# EAGLE design Bus Definition V1.2 (EAGLE 7.6.0)
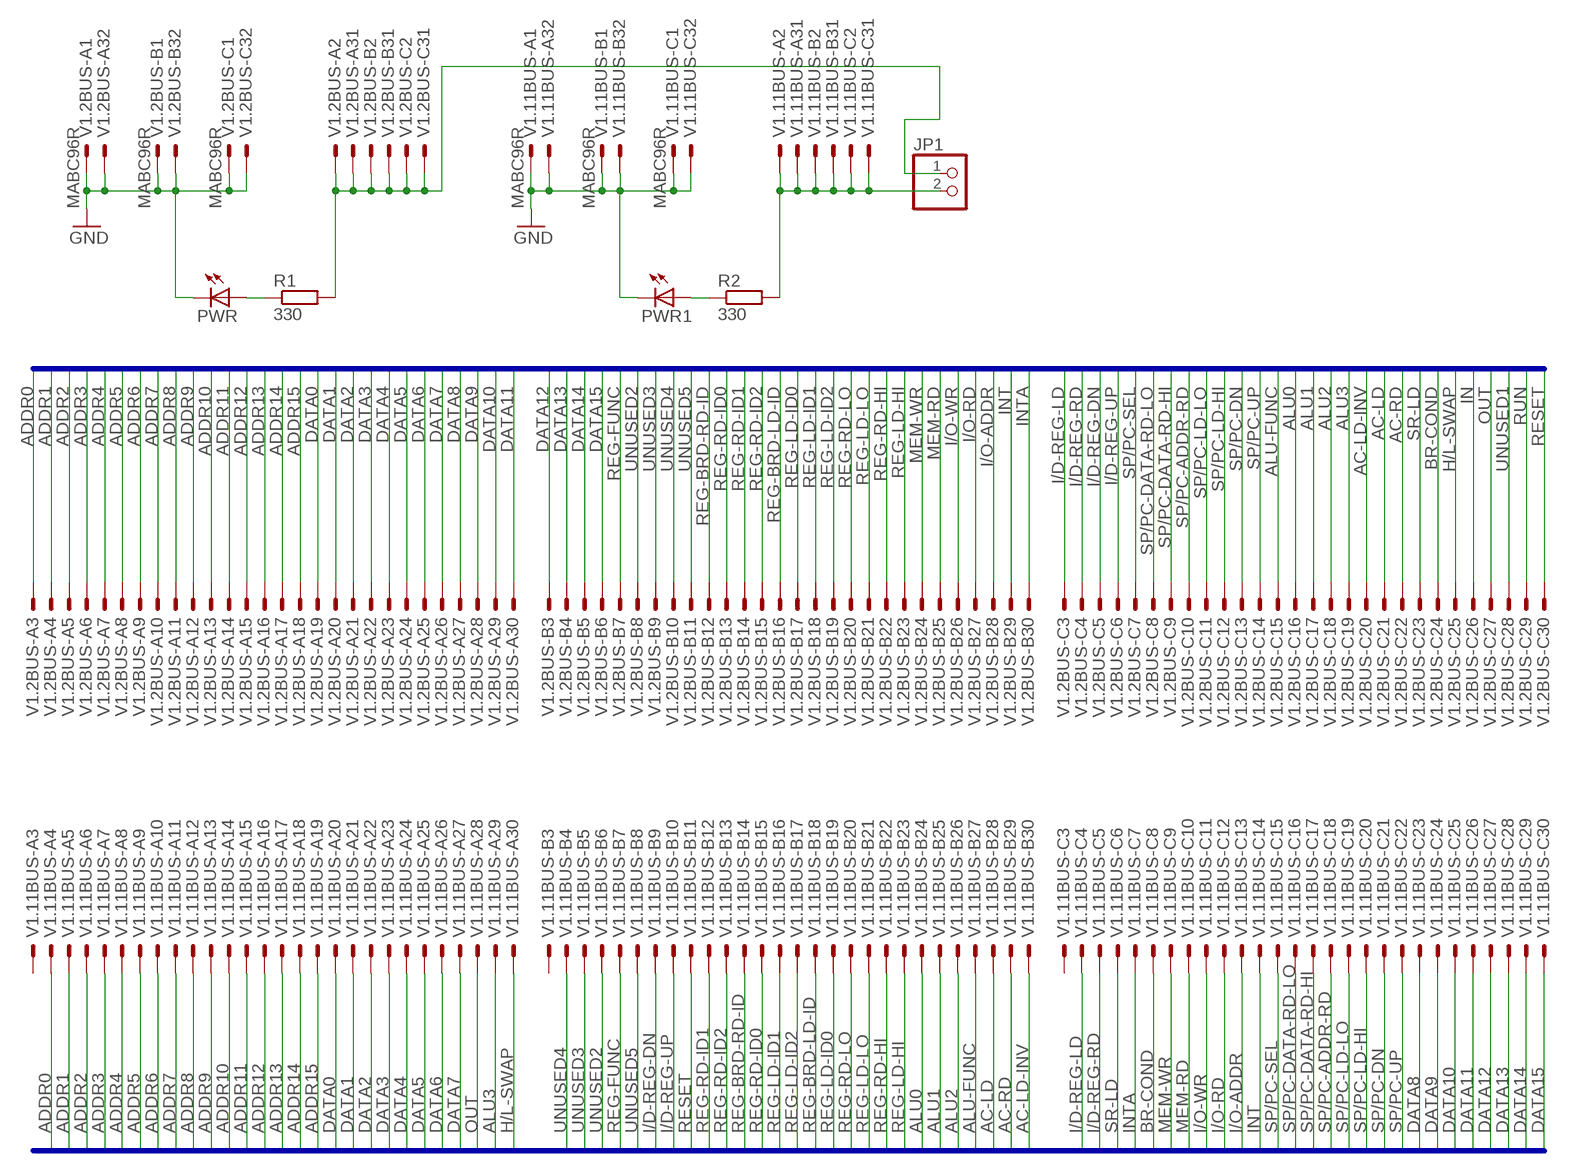
[diagram p0: schematic, sheet 1]

## Parts
JP1  PINHD-1X2  [1X02]
PWR  LED5MM  [LED5MM]
PWR1  LED5MM  [LED5MM]
R1  330  R0207/10  [0207/10]
R2  330  R0207/10  [0207/10]
V1.2BUS  MABC96R  [MABC96R]
V1.11BUS  MABC96R  [MABC96R]

## Nets
AC-LD: V1.2BUS.C21 V1.11BUS.B28
AC-LD-INV: V1.2BUS.C20 V1.11BUS.B30
AC-RD: V1.2BUS.C22 V1.11BUS.B29
ADDR0: V1.2BUS.A3 V1.11BUS.A4
ADDR1: V1.2BUS.A4 V1.11BUS.A5
ADDR2: V1.2BUS.A5 V1.11BUS.A6
ADDR3: V1.2BUS.A6 V1.11BUS.A7
ADDR4: V1.2BUS.A7 V1.11BUS.A8
ADDR5: V1.2BUS.A8 V1.11BUS.A9
ADDR6: V1.2BUS.A9 V1.11BUS.A10
ADDR7: V1.2BUS.A10 V1.11BUS.A11
ADDR8: V1.2BUS.A11 V1.11BUS.A12
ADDR9: V1.2BUS.A12 V1.11BUS.A13
ADDR10: V1.2BUS.A13 V1.11BUS.A14
ADDR11: V1.2BUS.A14 V1.11BUS.A15
ADDR12: V1.2BUS.A15 V1.11BUS.A16
ADDR13: V1.2BUS.A16 V1.11BUS.A17
ADDR14: V1.2BUS.A17 V1.11BUS.A18
ADDR15: V1.2BUS.A18 V1.11BUS.A19
ALU0: V1.2BUS.C16 V1.11BUS.B24
ALU1: V1.2BUS.C17 V1.11BUS.B25
ALU2: V1.2BUS.C18 V1.11BUS.B26
ALU3: V1.2BUS.C19 V1.11BUS.A29
ALU-FUNC: V1.2BUS.C15 V1.11BUS.B27
BR-COND: V1.2BUS.C24 V1.11BUS.C8
DATA0: V1.2BUS.A19 V1.11BUS.A20
DATA1: V1.2BUS.A20 V1.11BUS.A21
DATA2: V1.2BUS.A21 V1.11BUS.A22
DATA3: V1.2BUS.A22 V1.11BUS.A23
DATA4: V1.2BUS.A23 V1.11BUS.A24
DATA5: V1.2BUS.A24 V1.11BUS.A25
DATA6: V1.2BUS.A25 V1.11BUS.A26
DATA7: V1.2BUS.A26 V1.11BUS.A27
DATA8: V1.2BUS.A27 V1.11BUS.C23
DATA9: V1.2BUS.A28 V1.11BUS.C24
DATA10: V1.2BUS.A29 V1.11BUS.C25
DATA11: V1.2BUS.A30 V1.11BUS.C26
DATA12: V1.2BUS.B3 V1.11BUS.C27
DATA13: V1.2BUS.B4 V1.11BUS.C28
DATA14: V1.2BUS.B5 V1.11BUS.C29
DATA15: V1.2BUS.B6 V1.11BUS.C30
GND [GND]: PWR1.K(C) PWR.K(C) V1.2BUS.A1 V1.2BUS.A32 V1.2BUS.B1 V1.2BUS.B32 V1.2BUS.C1 V1.2BUS.C32 V1.11BUS.A1 V1.11BUS.A32 V1.11BUS.B1 V1.11BUS.B32 V1.11BUS.C1 V1.11BUS.C32
H/L-SWAP: V1.2BUS.C25 V1.11BUS.A30
I/D-REG-DN: V1.2BUS.C5 V1.11BUS.B9
I/D-REG-LD: V1.2BUS.C3 V1.11BUS.C4
I/D-REG-RD: V1.2BUS.C4 V1.11BUS.C5
I/D-REG-UP: V1.2BUS.C6 V1.11BUS.B10
I/O-ADDR: V1.2BUS.B28 V1.11BUS.C13
I/O-RD: V1.2BUS.B27 V1.11BUS.C12
I/O-WR: V1.2BUS.B26 V1.11BUS.C11
IN: V1.2BUS.C26
INT: V1.2BUS.B29 V1.11BUS.C14
INTA: V1.2BUS.B30 V1.11BUS.C7
MEM-RD: V1.2BUS.B25 V1.11BUS.C10
MEM-WR: V1.2BUS.B24 V1.11BUS.C9
N$1: PWR1.A R2.1
N$10: PWR.A R1.1
OUT: V1.2BUS.C27 V1.11BUS.A28
REG-BRD-LD-ID: V1.2BUS.B16 V1.11BUS.B18
REG-BRD-RD-ID: V1.2BUS.B12 V1.11BUS.B14
REG-FUNC: V1.2BUS.B7 V1.11BUS.B7
REG-LD-HI: V1.2BUS.B23 V1.11BUS.B23
REG-LD-ID0: V1.2BUS.B17 V1.11BUS.B19
REG-LD-ID1: V1.2BUS.B18 V1.11BUS.B16
REG-LD-ID2: V1.2BUS.B19 V1.11BUS.B17
REG-LD-LO: V1.2BUS.B21 V1.11BUS.B21
REG-RD-HI: V1.2BUS.B22 V1.11BUS.B22
REG-RD-ID0: V1.2BUS.B13 V1.11BUS.B15
REG-RD-ID1: V1.2BUS.B14 V1.11BUS.B12
REG-RD-ID2: V1.2BUS.B15 V1.11BUS.B13
REG-RD-LO: V1.2BUS.B20 V1.11BUS.B20
RESET: V1.2BUS.C30 V1.11BUS.B11
RUN: V1.2BUS.C29
SP/PC-ADDR-RD: V1.2BUS.C10 V1.11BUS.C18
SP/PC-DATA-RD-HI: V1.2BUS.C9 V1.11BUS.C17
SP/PC-DATA-RD-LO: V1.2BUS.C8 V1.11BUS.C16
SP/PC-DN: V1.2BUS.C13 V1.11BUS.C21
SP/PC-LD-HI: V1.2BUS.C12 V1.11BUS.C20
SP/PC-LD-LO: V1.2BUS.C11 V1.11BUS.C19
SP/PC-SEL: V1.2BUS.C7 V1.11BUS.C15
SP/PC-UP: V1.2BUS.C14 V1.11BUS.C22
SR-LD: V1.2BUS.C23 V1.11BUS.C6
UNUSED1: V1.2BUS.C28
UNUSED2: V1.2BUS.B8 V1.11BUS.B6
UNUSED3: V1.2BUS.B9 V1.11BUS.B5
UNUSED4: V1.2BUS.B10 V1.11BUS.B4
UNUSED5: V1.2BUS.B11 V1.11BUS.B8
VCC1 [VCC1]: JP1.1 R1.2 V1.2BUS.A2 V1.2BUS.A31 V1.2BUS.B2 V1.2BUS.B31 V1.2BUS.C2 V1.2BUS.C31
VCC2 [VCC2]: JP1.2 R2.2 V1.11BUS.A2 V1.11BUS.A31 V1.11BUS.B2 V1.11BUS.B31 V1.11BUS.C2 V1.11BUS.C31
Unconnected: V1.11BUS.A3 V1.11BUS.B3 V1.11BUS.C3

## Buses
ADDR[0..15],DATA[0..15],REG-FUNC,REG-BRD-RD-ID,REG-RD-ID[0..2],REG-BRD-LD-ID,REG-LD-ID[0..2],REG-RD-LO,REG-LD-LO,REG-RD-HI,REG-LD-HI,MEM-WR,MEM-RD,I/O-WR,I/O-RD,I/O-ADDR,INT,INTA,I/D-REG-LD,I/D-REG-RD,I/D-REG-DN,I/D-REG-UP,SP/PC-SEL,SP/PC-DATA-RD-LO,SP/PC-DATA-RD-HI,SP/PC-ADDR-RD,SP/PC-LD-LO,SP/PC-LD-HI,SP/PC-DN,SP/PC-UP,ALU-FUNC,ALU[0..3],AC-LD-INV,AC-LD,AC-RD,SR-LD,BR-COND,H/L-SWAP,IN,OUT,UNUSED[1..5],RESET
ADDR[0..15],DATA[0..15],REG-FUNC,REG-BRD-RD-ID,REG-RD-ID[0..2],REG-BRD-LD-ID,REG-LD-ID[0..2],REG-RD-LO,REG-LD-LO,REG-RD-HI,REG-LD-HI,MEM-WR,MEM-RD,I/O-WR,I/O-RD,I/O-ADDR,INT,INTA,I/D-REG-LD,I/D-REG-RD,I/D-REG-DN,I/D-REG-UP,SP/PC-SEL,SP/PC-DATA-RD-LO,SP/PC-DATA-RD-HI,SP/PC-ADDR-RD,SP/PC-LD-LO,SP/PC-LD-HI,SP/PC-DN,SP/PC-UP,ALU-FUNC,ALU[0..3],AC-LD-INV,AC-LD,AC-RD,SR-LD,BR-COND,H/L-SWAP,IN,OUT,UNUSED[1..5],RUN,RESET

## Library data of the parts
JP1 = pinhead:PINHD-1X2: PIN HEADER
PWR PWR1 = led:LED: LED OSRAM: - CHIPLED LG R971, LG N971, LY N971, LG Q971, LY Q971, LO R971, LY R971 LH N974, LH R974 LS Q976, LO Q976, LY Q976 LO Q996 - Hyper CHIPLED LW Q18S LB Q993, LB Q99A, LB R99A - SideLED LS A670, LO A670, LY A670, LG A670, LP A670 LB A673, LV A673, LT A673, LW A673 LH A674 LY A675 LS A676, LA A676, LO A676, LY A676, LW A676 LS A679, LY A679, LG A679 - Hyper Micro SIDELED® LS Y876, LA Y876, LO Y876, LY Y876 LT Y87S - SmartLED LW L88C, LW L88S LB L89C, LB L89S, LG L890 LS L89K, LO L89K, LY L89K LS L896, LA L896, LO L896, LY L896 - TOPLED LS T670, LO T670, LY T670, LG T670, LP T670 LSG T670, LSP T670, LSY T670, LOP T670, LYG T670 LG T671, LOG T671, LSG T671 LB T673, LV T673, LT T673, LW T673 LH T674 LS T676, LA T676, LO T676, LY T676, LB T676, LH T676, LSB T676, LW T676 LB T67C, LV T67C, LT T67C, LS T67K, LO T67K, LY T67K, LW E67C LS E67B, LA E67B, LO E67B, LY E67B, LB E67C, LV E67C, LT E67C LW T67C LS T679, LY T679, LG T679 LS T770, LO T770, LY T770, LG T770, LP T770 LB T773, LV T773, LT T773, LW T773 LH T774 LS E675, LA E675, LY E675, LS T675 LS T776, LA T776, LO T776, LY T776, LB T776 LHGB T686 LT T68C, LB T68C - Hyper Mini TOPLED® LB M676 - Mini TOPLED Santana® LG M470 LS M47K, LO M47K, LY M47K Source: http://www.osram.convergy.de LUXEON: - LUMILED® LXK2-PW12-R00, LXK2-PW12-S00, LXK2-PW14-U00, LXK2-PW14-V00 LXK2-PM12-R00, LXK2-PM12-S00, LXK2-PM14-U00 LXK2-PE12-Q00, LXK2-PE12-R00, LXK2-PE12-S00, LXK2-PE14-T00, LXK2-PE14-U00 LXK2-PB12-K00, LXK2-PB12-L00, LXK2-PB12-M00, LXK2-PB14-N00, LXK2-PB14-P00, LXK2-PB14-Q00 LXK2-PR12-L00, LXK2-PR12-M00, LXK2-PR14-Q00, LXK2-PR14-R00 LXK2-PD12-Q00, LXK2-PD12-R00, LXK2-PD12-S00 LXK2-PH12-R00, LXK2-PH12-S00 LXK2-PL12-P00, LXK2-PL12-Q00, LXK2-PL12-R00 Source: www.luxeon.com KINGBRIGHT: KA-3528ASYC Source: www.kingbright.com
R1 R2 = eagle-ltspice:R: RESISTOR, European symbol; SPICEMODEL: NONE; SPICEPREFIX: R
V1.2BUS V1.11BUS = con-vg:MABC96R: CONNECTOR male, 96 pins, type R, rows ABC, grid 2.54 mm

## Net classes
1 GND: width 0.508 mm
2 VCC1: width 0.508 mm
3 VCC2: width 0.508 mm

## Board
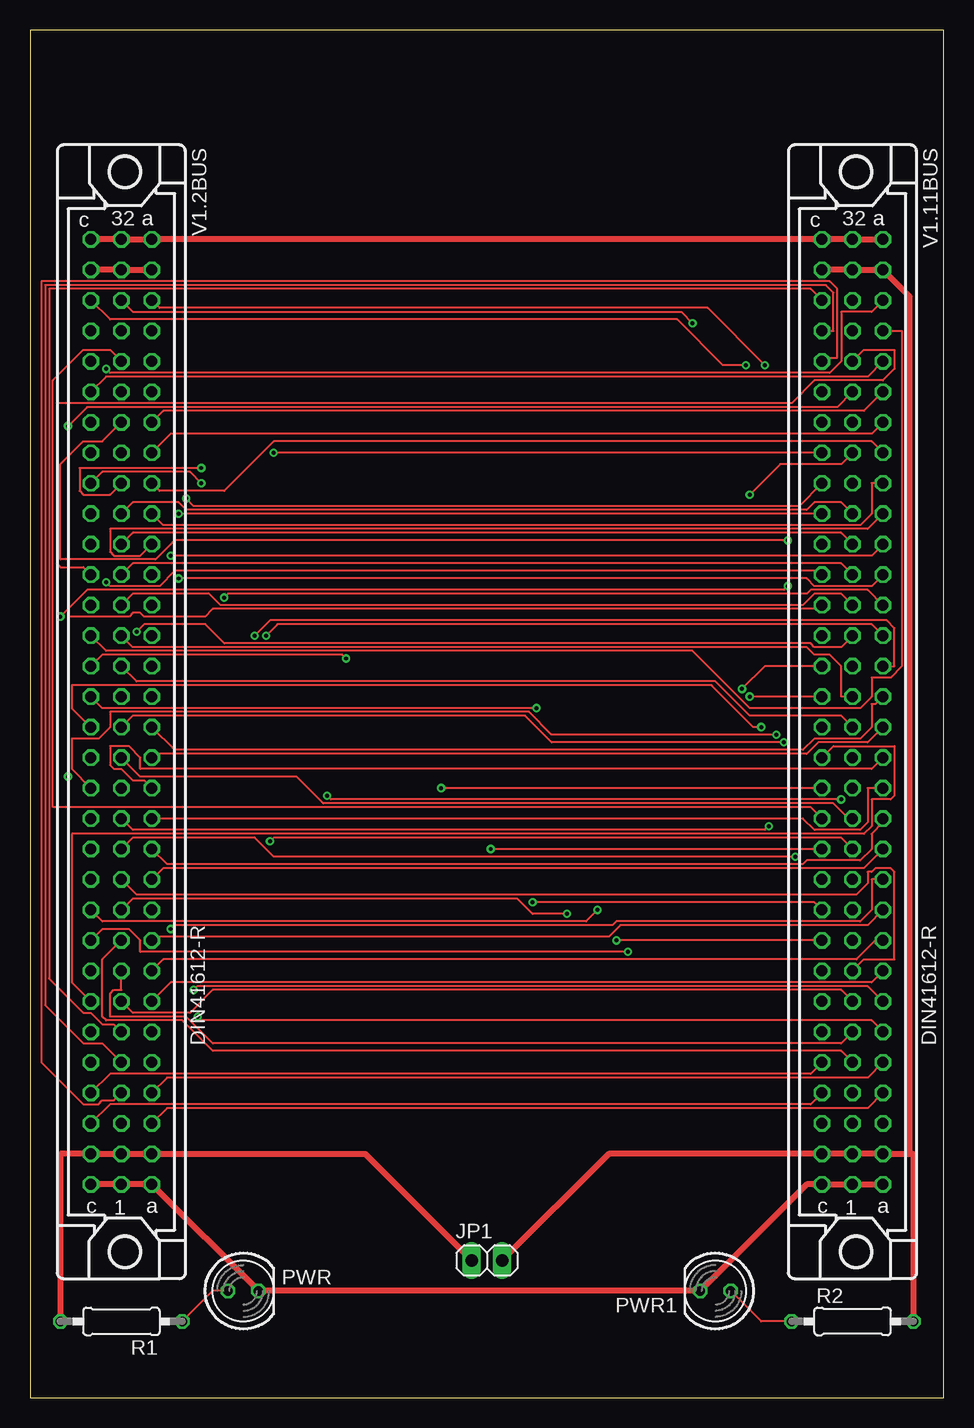
[diagram p1: board, top side]
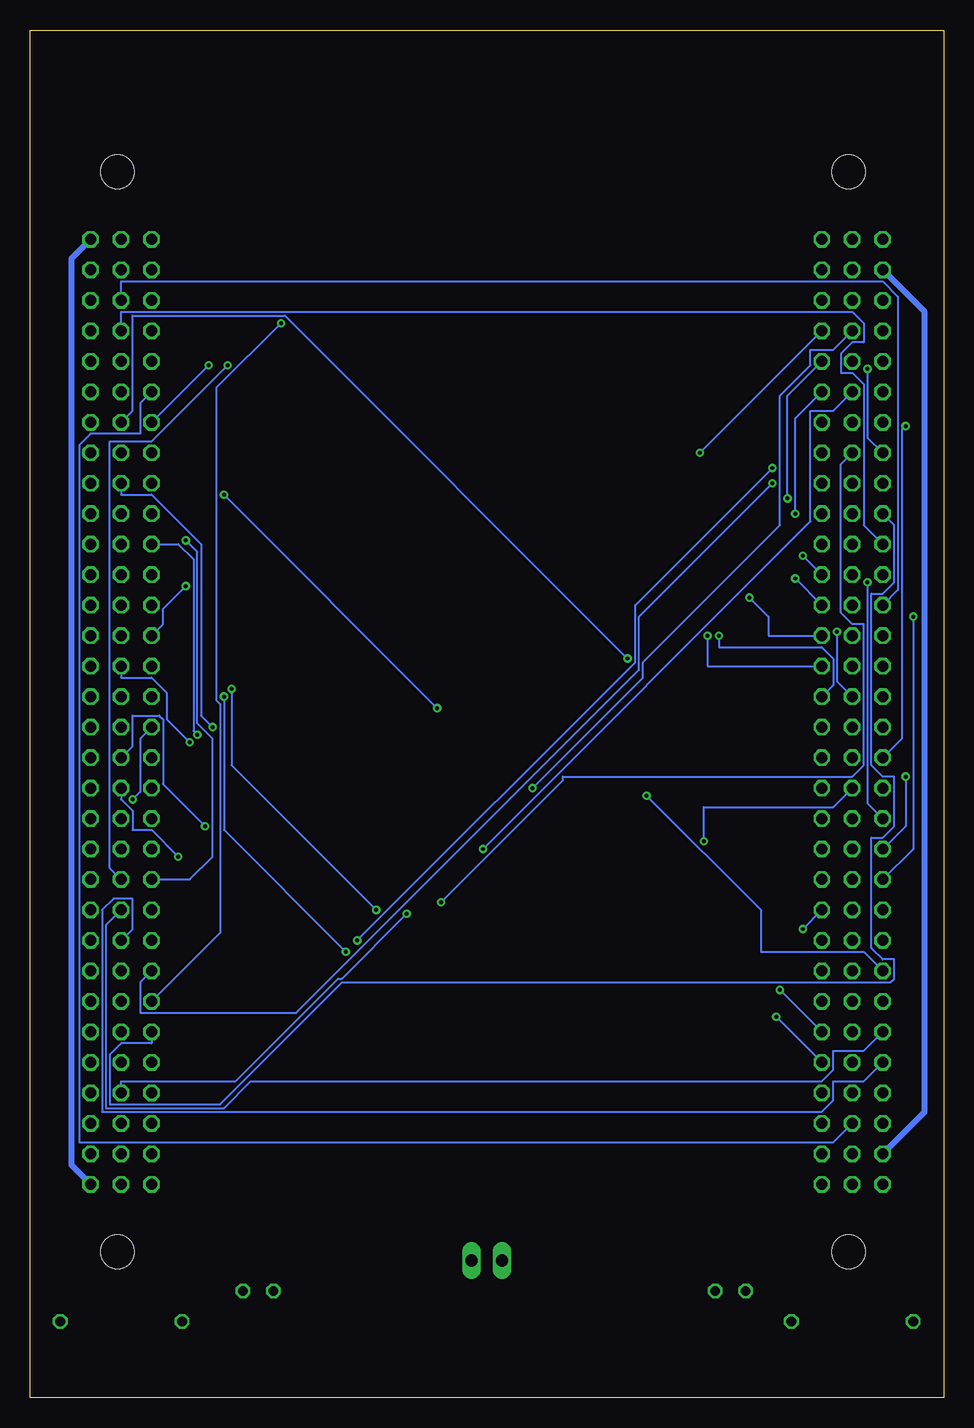
[diagram p2: board, bottom side, seen from below]

Size 76.18 x 113.97 mm. Coordinates in mm from the lower left corner, seen from the top.
Outline: 0,0 76.18,0 76.18,113.97 0,113.97 0,0
Copper layers (1*16): Top 0.0356mm / dielectric 1.5011mm / Bottom 0.0356mm
Design rules "LaenPCBOrder": minimum track width 6mil, minimum drill 13mil, track to track 6mil, track to pad 6mil, pad to pad 6mil, via to via 6mil, smd to smd 6mil, copper to edge 15mil, drill to drill 6mil, minimum pad ring 7mil, minimum via ring 7mil, stop-mask expansion 3mil, vias tented up to drill 0mil, thermal gap 10mil

### Footprints (pad centres in the part's own frame; a part is rotated, then mirrored left to right if it is on the bottom)
1X02 = drill 1.016 long: 1 -1.27,0; 2 1.27,0
LED5MM = drill 0.813 octagon: A -1.27,0; K 1.27,0
0207/10 = drill 0.813 octagon: 1 -5.08,0; 2 5.08,0
MABC96R = drill 0.914 octagon: A1 -2.54,39.37; A2 -2.54,36.83; A3 -2.54,34.29; A4 -2.54,31.75; A5 -2.54,29.21; A6 -2.54,26.67; A7 -2.54,24.13; A8 -2.54,21.59; A9 -2.54,19.05; A10 -2.54,16.51; A11 -2.54,13.97; A12 -2.54,11.43; A13 -2.54,8.89; A14 -2.54,6.35; A15 -2.54,3.81; A16 -2.54,1.27; A17 -2.54,-1.27; A18 -2.54,-3.81; A19 -2.54,-6.35; A20 -2.54,-8.89; A21 -2.54,-11.43; A22 -2.54,-13.97; A23 -2.54,-16.51; A24 -2.54,-19.05; A25 -2.54,-21.59; A26 -2.54,-24.13; A27 -2.54,-26.67; A28 -2.54,-29.21; A29 -2.54,-31.75; A30 -2.54,-34.29; A31 -2.54,-36.83; A32 -2.54,-39.37; B1 0,39.37; B2 0,36.83; B3 0,34.29; B4 0,31.75; B5 0,29.21; B6 0,26.67; B7 0,24.13; B8 0,21.59; B9 0,19.05; B10 0,16.51; B11 0,13.97; B12 0,11.43; B13 0,8.89; B14 0,6.35; B15 0,3.81; B16 0,1.27; B17 0,-1.27; B18 0,-3.81; B19 0,-6.35; B20 0,-8.89; B21 0,-11.43; B22 0,-13.97; B23 0,-16.51; B24 0,-19.05; B25 0,-21.59; B26 0,-24.13; B27 0,-26.67; B28 0,-29.21; B29 0,-31.75; B30 0,-34.29; B31 0,-36.83; B32 0,-39.37; C1 2.54,39.37; C2 2.54,36.83; C3 2.54,34.29; C4 2.54,31.75; C5 2.54,29.21; C6 2.54,26.67; C7 2.54,24.13; C8 2.54,21.59; C9 2.54,19.05; C10 2.54,16.51; C11 2.54,13.97; C12 2.54,11.43; C13 2.54,8.89; C14 2.54,6.35; C15 2.54,3.81; C16 2.54,1.27; C17 2.54,-1.27; C18 2.54,-3.81; C19 2.54,-6.35; C20 2.54,-8.89; C21 2.54,-11.43; C22 2.54,-13.97; C23 2.54,-16.51; C24 2.54,-19.05; C25 2.54,-21.59; C26 2.54,-24.13; C27 2.54,-26.67; C28 2.54,-29.21; C29 2.54,-31.75; C30 2.54,-34.29; C31 2.54,-36.83; C32 2.54,-39.37 | hole 2.794: -0.305,45; -0.305,-45

### Placement (x,y rotation side)
JP1  38.1,11.43 0 top
PWR  17.78,8.89 0 top
PWR1  57.15,8.89 180 top
R1  7.62,6.35 180 top
R2  68.58,6.35 0 top
V1.2BUS  7.62,57.15 180 top
V1.11BUS  68.58,57.15 180 top

### Tracks (layer width: path | path; a pad name or v marks a point on that pad's centre or on a via)
AC-LD
  Top 0.152: V1.2BUS.C21 4.45,69.22 2.54,69.22 2.22,69.53 2.22,82.87 63.5,82.87 65.41,84.77 71.12,84.77 72.07,85.72 72.07,87.31 69.53,87.31 V1.11BUS.B28
AC-LD-INV
  Bottom 0.152: V1.2BUS.C20 3.81,67.31 3.81,91.76 5.08,93.03 68.58,93.03 V1.11BUS.B30
AC-RD
  Bottom 0.152: V1.2BUS.C22 6.67,72.71 6.67,84.45 7.62,85.41 8.57,85.41 8.57,87 7.62,87.95 6.67,87.95 6.67,89.53 7.62,90.49 68.58,90.49 V1.11BUS.B29
ADDR0
  Top 0.152: V1.2BUS.A3 11.43,24.13 69.85,24.13 V1.11BUS.A4
ADDR1
  Top 0.152: V1.2BUS.A4 11.43,26.67 69.85,26.67 V1.11BUS.A5
ADDR2  (via drill 0.33)
  Top 0.152: v13.97,31.75 14.29,31.43 70.17,31.43 V1.11BUS.A6
  Bottom 0.152: v13.97,31.75 V1.2BUS.A5
ADDR3  (via drill 0.33)
  Top 0.152: v13.65,33.97 13.97,34.29 69.85,34.29 V1.11BUS.A7
  Bottom 0.152: v13.65,33.97 V1.2BUS.A6
ADDR4
  Top 0.152: V1.2BUS.A7 11.75,34.61 70.17,34.61 V1.11BUS.A8
ADDR5
  Top 0.152: V1.2BUS.A8 11.11,36.51 68.9,36.51 70.48,38.1 V1.11BUS.A9
ADDR6
  Top 0.152: V1.2BUS.A9 10.48,38.42 48.26,38.42 49.21,39.37 69.85,39.37 V1.11BUS.A10
ADDR7  (via drill 0.33)
  Top 0.152: v11.75,39.05 12.06,39.37 48.58,39.37 48.9,39.69 69.22,39.69 70.17,40.64 70.17,43.18 V1.11BUS.A11
  Bottom 0.152: v11.75,39.05 V1.2BUS.A10
ADDR8
  Top 0.152: V1.2BUS.A11 11.11,44.13 69.53,44.13 V1.11BUS.A12
ADDR9
  Top 0.152: V1.2BUS.A12 11.43,44.45 64.45,44.45 64.77,44.77 69.22,44.77 70.17,45.72 70.17,46.99 71.12,47.94 V1.11BUS.A13
ADDR10
  Top 0.152: V1.2BUS.A13 64.45,48.26 65.41,47.31 69.22,47.31 69.85,47.94 69.85,50.8 V1.11BUS.A14
ADDR11
  Top 0.152: V1.2BUS.A14 9.53,51.44 8.57,51.44 7.62,52.39 6.99,52.39 6.67,52.7 6.67,54.29 8.26,54.29 9.21,53.34 9.21,52.39 70.17,52.39 V1.11BUS.A15
ADDR12
  Top 0.152: V1.2BUS.A15 10.48,53.66 64.77,53.66 65.72,54.61 69.85,54.61 V1.11BUS.A16
ADDR13
  Top 0.152: V1.2BUS.A16 12.06,53.98 64.45,53.98 65.41,54.93 69.22,54.93 70.17,55.88 70.17,57.78 70.48,57.78 V1.11BUS.A17
ADDR14  (via drill 0.33)
  Top 0.152: v18.73,63.5 20,64.77 71.44,64.77 72.07,64.14 72.07,60.96 V1.11BUS.A18
  Bottom 0.152: V1.2BUS.A17 9.21,59.37 9.21,61.59 10.16,62.55 18.73,62.55 v18.73,63.5
ADDR15  (via drill 0.33)
  Top 0.152: v19.68,63.5 20.64,64.45 70.17,64.45 V1.11BUS.A19
  Bottom 0.152: V1.2BUS.A18 19.68,60.96 v19.68,63.5
ALU0  (via drill 0.33)
  Top 0.152: V1.2BUS.C16 3.49,57.47 3.49,59.37 56.83,59.37 60.33,55.88 v60.96,55.88
  Bottom 0.152: v60.96,55.88 61.91,56.83 61.91,71.12 66.04,75.25 68.58,75.25 V1.11BUS.B24
ALU1  (via drill 0.33)
  Top 0.152: V1.2BUS.C17 6.03,57.47 v42.23,57.47 | v60.01,75.25 62.55,77.79 67.63,77.79 V1.11BUS.B25
  Bottom 0.152: v60.01,75.25 v42.23,57.47
ALU2  (via drill 0.33)
  Top 0.152: V1.2BUS.C18 6.03,61.91 26.04,61.91 v26.35,61.59
  Bottom 0.152: v26.35,61.59 54.93,90.17 67.63,90.17 67.63,82.23 V1.11BUS.B26
ALU3
  Top 0.152: V1.2BUS.C19 6.35,62.23 55.24,62.23 60.01,57.47 69.22,57.47 70.17,58.42 70.17,60.01 71.75,60.01 72.71,60.96 72.71,88.9 V1.11BUS.A29
ALU-FUNC  (via drill 0.33)
  Top 0.152: v3.17,80.96 4.76,82.55 67.31,82.55 V1.11BUS.B27
  Bottom 0.152: V1.2BUS.C15 3.49,54.93 3.49,80.64 v3.17,80.96
BR-COND  (via drill 0.33)
  Top 0.152: V1.2BUS.C24 6.03,77.15 13.34,77.15 v14.29,76.2
  Bottom 0.152: v14.29,76.2 25.4,65.09 25.4,60.64 53.98,32.07 66.99,32.07 66.99,34.61 V1.11BUS.C8
DATA0  (via drill 0.33)
  Top 0.152: v16.19,66.67 16.51,66.99 64.77,66.99 65.09,67.31 69.85,67.31 V1.11BUS.A20
  Bottom 0.152: V1.2BUS.A19 14.61,63.5 14.61,65.09 v16.19,66.67
DATA1  (via drill 0.33)
  Top 0.152: v12.38,68.26 64.77,68.26 65.41,67.63 70.17,67.63 V1.11BUS.A21
  Bottom 0.152: v12.38,68.26 V1.2BUS.A20
DATA2  (via drill 0.33)
  Top 0.152: v11.75,70.17 70.17,70.17 V1.11BUS.A22
  Bottom 0.152: v11.75,70.17 V1.2BUS.A21
DATA3
  Top 0.152: V1.2BUS.A22 9.21,70.17 6.99,70.17 6.67,70.48 6.67,72.39 69.85,72.39 V1.11BUS.A23
DATA4
  Top 0.152: V1.2BUS.A23 11.11,72.71 69.22,72.71 70.17,73.66 70.17,76.2 V1.11BUS.A24
DATA5
  Top 0.152: V1.2BUS.A24 10.79,75.56 16.19,75.56 20.32,79.69 70.17,79.69 V1.11BUS.A25
DATA6
  Top 0.152: V1.2BUS.A25 11.75,80.33 70.17,80.33 V1.11BUS.A26
DATA7
  Top 0.152: V1.2BUS.A26 11.11,82.23 69.53,82.23 V1.11BUS.A27
DATA8  (via drill 0.33)
  Top 0.152: V1.11BUS.C23 v12.38,73.66
  Bottom 0.152: V1.2BUS.A27 12.38,81.6 v12.38,73.66
DATA9  (via drill 0.33)
  Top 0.152: v13.02,74.93 13.65,74.3 64.14,74.3 V1.11BUS.C24
  Bottom 0.152: V1.2BUS.A28 13.02,83.5 v13.02,74.93
DATA10  (via drill 0.33)
  Top 0.152: V1.11BUS.C25 v20.32,78.74
  Bottom 0.152: v20.32,78.74 V1.2BUS.A29
DATA11  (via drill 0.33)
  Top 0.152: V1.2BUS.A30 10.79,90.81 56.52,90.81 v61.28,86.04
  Bottom 0.152: V1.11BUS.C26 v61.28,86.04
DATA12
  Bottom 0.152: V1.2BUS.B3 9.21,21.27 72.07,21.27 72.07,79.38 71.12,80.33 66.99,80.33 66.99,82.87 V1.11BUS.C27
DATA13
  Top 0.152: V1.2BUS.B4 6.99,24.77 6.03,24.77 5.71,24.45 4.45,24.45 0.95,27.94 0.95,93.03 66.67,93.03 67.31,92.39 67.31,86.68 66.36,86.68 V1.11BUS.C28
DATA14
  Top 0.152: V1.2BUS.B5 6.03,29.53 4.45,29.53 1.27,32.7 1.27,92.71 66.36,92.71 66.99,92.08 66.99,88.9 V1.11BUS.C29
DATA15
  Top 0.152: V1.2BUS.B6 6.99,31.11 6.03,31.11 5.08,32.07 4.45,32.07 1.59,34.92 1.59,92.39 65.09,92.39 V1.11BUS.C30
GND
  Top 0.508: V1.2BUS.C32 V1.2BUS.B32 V1.2BUS.A32 V1.11BUS.C32 V1.11BUS.B32 V1.11BUS.A32 | V1.2BUS.C1 V1.2BUS.B1 V1.2BUS.A1 PWR.K PWR1.K 64.77,17.78 V1.11BUS.C1 V1.11BUS.B1 V1.11BUS.A1
  Bottom 0.508: V1.11BUS.A32 72.71,94.93 72.71,19.37 V1.11BUS.A1
H/L-SWAP  (via drill 0.33)
  Top 0.152: v6.35,85.72 6.67,85.41 66.67,85.41 67.63,86.36 67.63,90.49 70.17,90.49 V1.11BUS.A30
  Bottom 0.152: V1.2BUS.C25 6.35,80.01 v6.35,85.72
I/D-REG-DN
  Bottom 0.152: V1.2BUS.C5 6.67,26.35 9.21,26.35 9.21,24.77 10.16,23.81 70.17,23.81 70.17,40.64 69.22,41.59 67.63,41.59 67.63,39.05 V1.11BUS.B9
I/D-REG-LD
  Top 0.152: V1.2BUS.C3 6.67,24.45 65.09,24.45 V1.11BUS.C4
I/D-REG-RD
  Top 0.152: V1.2BUS.C4 6.67,26.99 65.09,26.99 V1.11BUS.C5
I/D-REG-UP
  Bottom 0.152: V1.2BUS.C6 6.67,28.89 9.21,28.89 9.21,27.3 10.16,26.35 57.78,26.35 60.01,24.13 69.85,24.13 69.85,39.37 V1.11BUS.B10
I/O-ADDR
  Top 0.152: V1.2BUS.B28 6.67,87.31 4.45,87.31 1.91,84.77 1.91,49.21 65.09,49.21 V1.11BUS.C13
I/O-RD  (via drill 0.33)
  Top 0.152: V1.11BUS.C12 v38.42,45.72
  Bottom 0.152: V1.2BUS.B27 9.21,82.23 11.11,82.23 11.11,73.03 v38.42,45.72
I/O-WR  (via drill 0.33)
  Top 0.152: V1.2BUS.B26 6.03,79.69 4.45,79.69 2.54,77.79 2.54,69.85 10.48,69.85 12.06,71.44 v63.18,71.44
  Bottom 0.152: v63.18,71.44 62.23,70.48 62.23,56.2 60.96,54.93 60.96,45.09 62.87,43.18 V1.11BUS.C11
INT  (via drill 0.33)
  Top 0.152: V1.11BUS.C14 v34.29,50.8
  Bottom 0.152: V1.2BUS.B29 9.21,87.31 11.11,87.31 11.11,86.04 13.65,83.5 13.65,72.71 25.08,61.28 25.08,60.01 v34.29,50.8
INTA  (via drill 0.33)
  Top 0.152: v55.24,89.53 54.29,90.49 8.57,90.49 V1.2BUS.B30
  Bottom 0.152: V1.11BUS.C7 60.33,38.73 60.33,57.78 60.64,58.1 60.64,84.14 v55.24,89.53
MEM-RD  (via drill 0.33)
  Top 0.152: v41.91,41.27 65.41,41.27 V1.11BUS.C10
  Bottom 0.152: V1.2BUS.B25 8.57,77.79 8.57,65.41 7.62,64.45 6.67,64.45 6.67,52.7 7.62,51.75 31.75,51.75 31.75,51.44 v41.91,41.27
MEM-WR  (via drill 0.33)
  Top 0.152: V1.2BUS.B24 6.67,75.25 4.45,75.25 4.13,75.56 4.13,77.47 v14.29,77.47 | V1.11BUS.C9 v48.9,38.1
  Bottom 0.152: v14.29,77.47 25.72,66.04 25.72,61.28 v48.9,38.1
N$1
  Top 0.152: PWR1.A 60.96,6.35 R2.1
N$10
  Top 0.152: R1.1 15.24,8.89 PWR.A
OUT
  Top 0.152: V1.2BUS.C27 6.35,85.09 69.85,85.09 V1.11BUS.A28
REG-BRD-LD-ID  (via drill 0.33)
  Top 0.152: V1.2BUS.B16 8.57,56.83 41.27,56.83 43.5,54.61 v62.87,54.61
  Bottom 0.152: v62.87,54.61 64.77,56.52 64.77,58.74 66.04,60.01 68.58,60.01 V1.11BUS.B18
REG-BRD-RD-ID  (via drill 0.33)
  Top 0.152: V1.2BUS.B12 8.57,46.67 18.73,46.67 20.32,45.09 v63.82,45.09
  Bottom 0.152: v63.82,45.09 66.04,47.31 67.63,47.31 67.63,48.9 68.58,49.85 V1.11BUS.B14
REG-FUNC
  Top 0.152: V1.2BUS.B7 8.57,32.07 13.34,32.07 15.24,33.97 67.63,33.97 V1.11BUS.B7
REG-LD-HI
  Top 0.152: V1.2BUS.B23 8.57,74.61 12.38,74.61 13.02,73.98 64.77,73.98 65.41,74.61 67.63,74.61 V1.11BUS.B23
REG-LD-ID0  (via drill 0.33)
  Top 0.152: v8.89,63.82 9.53,64.45 14.61,64.45 16.19,62.87 65.09,62.87 65.41,62.55 67.63,62.55 V1.11BUS.B19
  Bottom 0.152: V1.2BUS.B17 8.89,59.69 v8.89,63.82
REG-LD-ID1
  Top 0.152: V1.2BUS.B18 8.89,59.69 57.15,59.69 60.01,56.83 67.63,56.83 V1.11BUS.B16
REG-LD-ID2
  Top 0.152: V1.2BUS.B19 8.57,62.55 64.77,62.55 65.41,61.91 66.67,61.91 67.63,60.96 67.63,58.42 V1.11BUS.B17
REG-LD-LO
  Top 0.152: V1.2BUS.B21 8.57,69.53 67.63,69.53 V1.11BUS.B21
REG-RD-HI
  Top 0.152: V1.2BUS.B22 8.57,72.07 67.63,72.07 V1.11BUS.B22
REG-RD-ID0  (via drill 0.33)
  Top 0.152: V1.2BUS.B13 8.57,47.31 61.28,47.31 v61.59,47.62
  Bottom 0.152: v61.59,47.62 65.09,51.12 65.09,56.52 65.41,56.83 67.63,56.83 67.63,54.29 V1.11BUS.B15
REG-RD-ID1  (via drill 0.33)
  Top 0.152: v20,46.35 20.32,46.67 67.63,46.67 V1.11BUS.B12
  Bottom 0.152: V1.2BUS.B14 9.21,49.21 20,49.21 v20,46.35
REG-RD-ID2
  Top 0.152: V1.2BUS.B15 9.21,51.75 22.23,51.75 24.45,49.53 66.99,49.53 68.26,48.26 V1.11BUS.B13
REG-RD-LO
  Top 0.152: V1.2BUS.B20 8.57,66.99 14.92,66.99 15.88,66.04 64.45,66.04 65.41,66.99 67.63,66.99 V1.11BUS.B20
RESET  (via drill 0.33)
  Top 0.152: V1.2BUS.C30 6.67,89.85 53.98,89.85 57.78,86.04 v59.69,86.04
  Bottom 0.152: v59.69,86.04 66.04,79.69 69.53,79.69 69.53,44.13 V1.11BUS.B11
SP/PC-ADDR-RD  (via drill 0.33)
  Top 0.152: V1.2BUS.C10 6.03,39.69 46.35,39.69 v47.31,40.64 | v59.37,59.05 61.28,60.96 V1.11BUS.C18
  Bottom 0.152: v47.31,40.64 59.37,52.7 v59.37,59.05
SP/PC-DATA-RD-HI  (via drill 0.33)
  Top 0.152: V1.2BUS.C9 6.03,39.05 8.26,39.05 9.21,38.1 9.21,37.15 v49.85,37.15 | V1.11BUS.C17 v60.01,58.42
  Bottom 0.152: v49.85,37.15 60.01,47.31 v60.01,58.42
SP/PC-DATA-RD-LO  (via drill 0.33)
  Top 0.152: v24.77,50.16 25.08,49.85 v67.63,49.85
  Bottom 0.152: V1.2BUS.C8 6.67,37.15 15.24,37.15 15.24,40.64 v24.77,50.16 | v67.63,49.85 66.99,50.48 66.99,54.93 V1.11BUS.C16
SP/PC-DN  (via drill 0.33)
  Top 0.152: v6.35,67.94 6.67,67.63 10.79,67.63 12.06,68.9 65.72,68.9 V1.11BUS.C21
  Bottom 0.152: V1.2BUS.C13 6.35,49.53 v6.35,67.94
SP/PC-LD-HI  (via drill 0.33)
  Top 0.152: v3.17,51.75 3.17,65.09 8.26,65.09 8.57,65.41 9.21,65.41 9.53,65.09 14.61,65.09 15.24,65.72 65.72,65.72 V1.11BUS.C20
  Bottom 0.152: V1.2BUS.C12 3.17,47.62 v3.17,51.75
SP/PC-LD-LO  (via drill 0.33)
  Top 0.152: v2.54,65.09 4.76,67.31 62.87,67.31 v63.18,67.63
  Bottom 0.152: V1.2BUS.C11 2.54,45.72 v2.54,65.09 | v63.18,67.63 65.09,65.72 65.09,64.45 V1.11BUS.C19
SP/PC-SEL
  Top 0.152: V1.2BUS.C7 3.49,34.61 3.49,46.99 69.53,46.99 70.17,47.62 70.17,49.85 71.75,49.85 72.07,50.16 72.07,54.29 66.99,54.29 V1.11BUS.C15
SP/PC-UP  (via drill 0.33)
  Top 0.152: V1.2BUS.C14 3.49,52.39 3.49,54.93 5.71,54.93 6.67,55.88 6.67,57.15 41.59,57.15 43.5,55.24 v62.23,55.24
  Bottom 0.152: v62.23,55.24 62.55,55.56 62.55,69.85 63.82,71.12 V1.11BUS.C22
SR-LD
  Bottom 0.152: V1.2BUS.C23 4.13,72.71 4.13,67.94 5.08,66.99 6.03,66.99 6.03,52.7 5.08,51.75 4.13,51.75 4.13,47.62 5.08,46.67 6.03,46.67 6.03,37.47 5.08,36.51 4.13,36.51 4.13,34.92 4.45,34.61 50.16,34.61 60.33,24.45 69.53,24.45 69.53,28.57 68.58,29.53 66.04,29.53 V1.11BUS.C6
UNUSED2
  Top 0.152: V1.2BUS.B8 7.62,33.97 6.99,33.97 6.67,33.66 6.67,31.75 13.02,31.75 15.24,29.53 67.63,29.53 V1.11BUS.B6
UNUSED3
  Top 0.152: V1.2BUS.B9 6.03,36.51 6.03,31.75 6.35,31.43 12.7,31.43 15.24,28.89 67.63,28.89 V1.11BUS.B5
UNUSED4  (via drill 0.33)
  Top 0.152: V1.2BUS.B10 8.57,41.59 40.64,41.59 41.91,40.32 v44.77,40.32
  Bottom 0.152: v44.77,40.32 50.16,34.92 50.48,34.92 59.05,26.35 68.58,26.35 V1.11BUS.B4
UNUSED5
  Top 0.152: V1.2BUS.B11 8.89,41.91 68.9,41.91 69.85,42.86 69.85,43.81 70.17,43.81 70.48,44.13 71.75,44.13 72.07,43.81 72.07,36.51 69.53,36.51 V1.11BUS.B8
VCC1
  Top 0.508: V1.2BUS.C31 V1.2BUS.B31 V1.2BUS.A31 | R1.2 2.54,20.32 V1.2BUS.C2 V1.2BUS.B2 V1.2BUS.A2 27.94,20.32 JP1.1
  Bottom 0.508: V1.2BUS.C31 1.59,90.49 1.59,23.81 V1.2BUS.C2
VCC2
  Top 0.508: JP1.2 48.26,20.32 V1.11BUS.C2 V1.11BUS.B2 V1.11BUS.A2 73.34,20.32 | V1.11BUS.C31 V1.11BUS.B31 V1.11BUS.A31 73.34,91.76 73.34,20.32 | R2.2 73.66,20.32 73.34,20.32

### Text on the board
tValues: YACC1 BUS CONVERTER BOARD V1.0 | V1.2 | V1.11 | onepagecomputer.com